# EAGLE design sensor (EAGLE 7.7.0)

## Sheet 1 of 2: MCU + Sensors
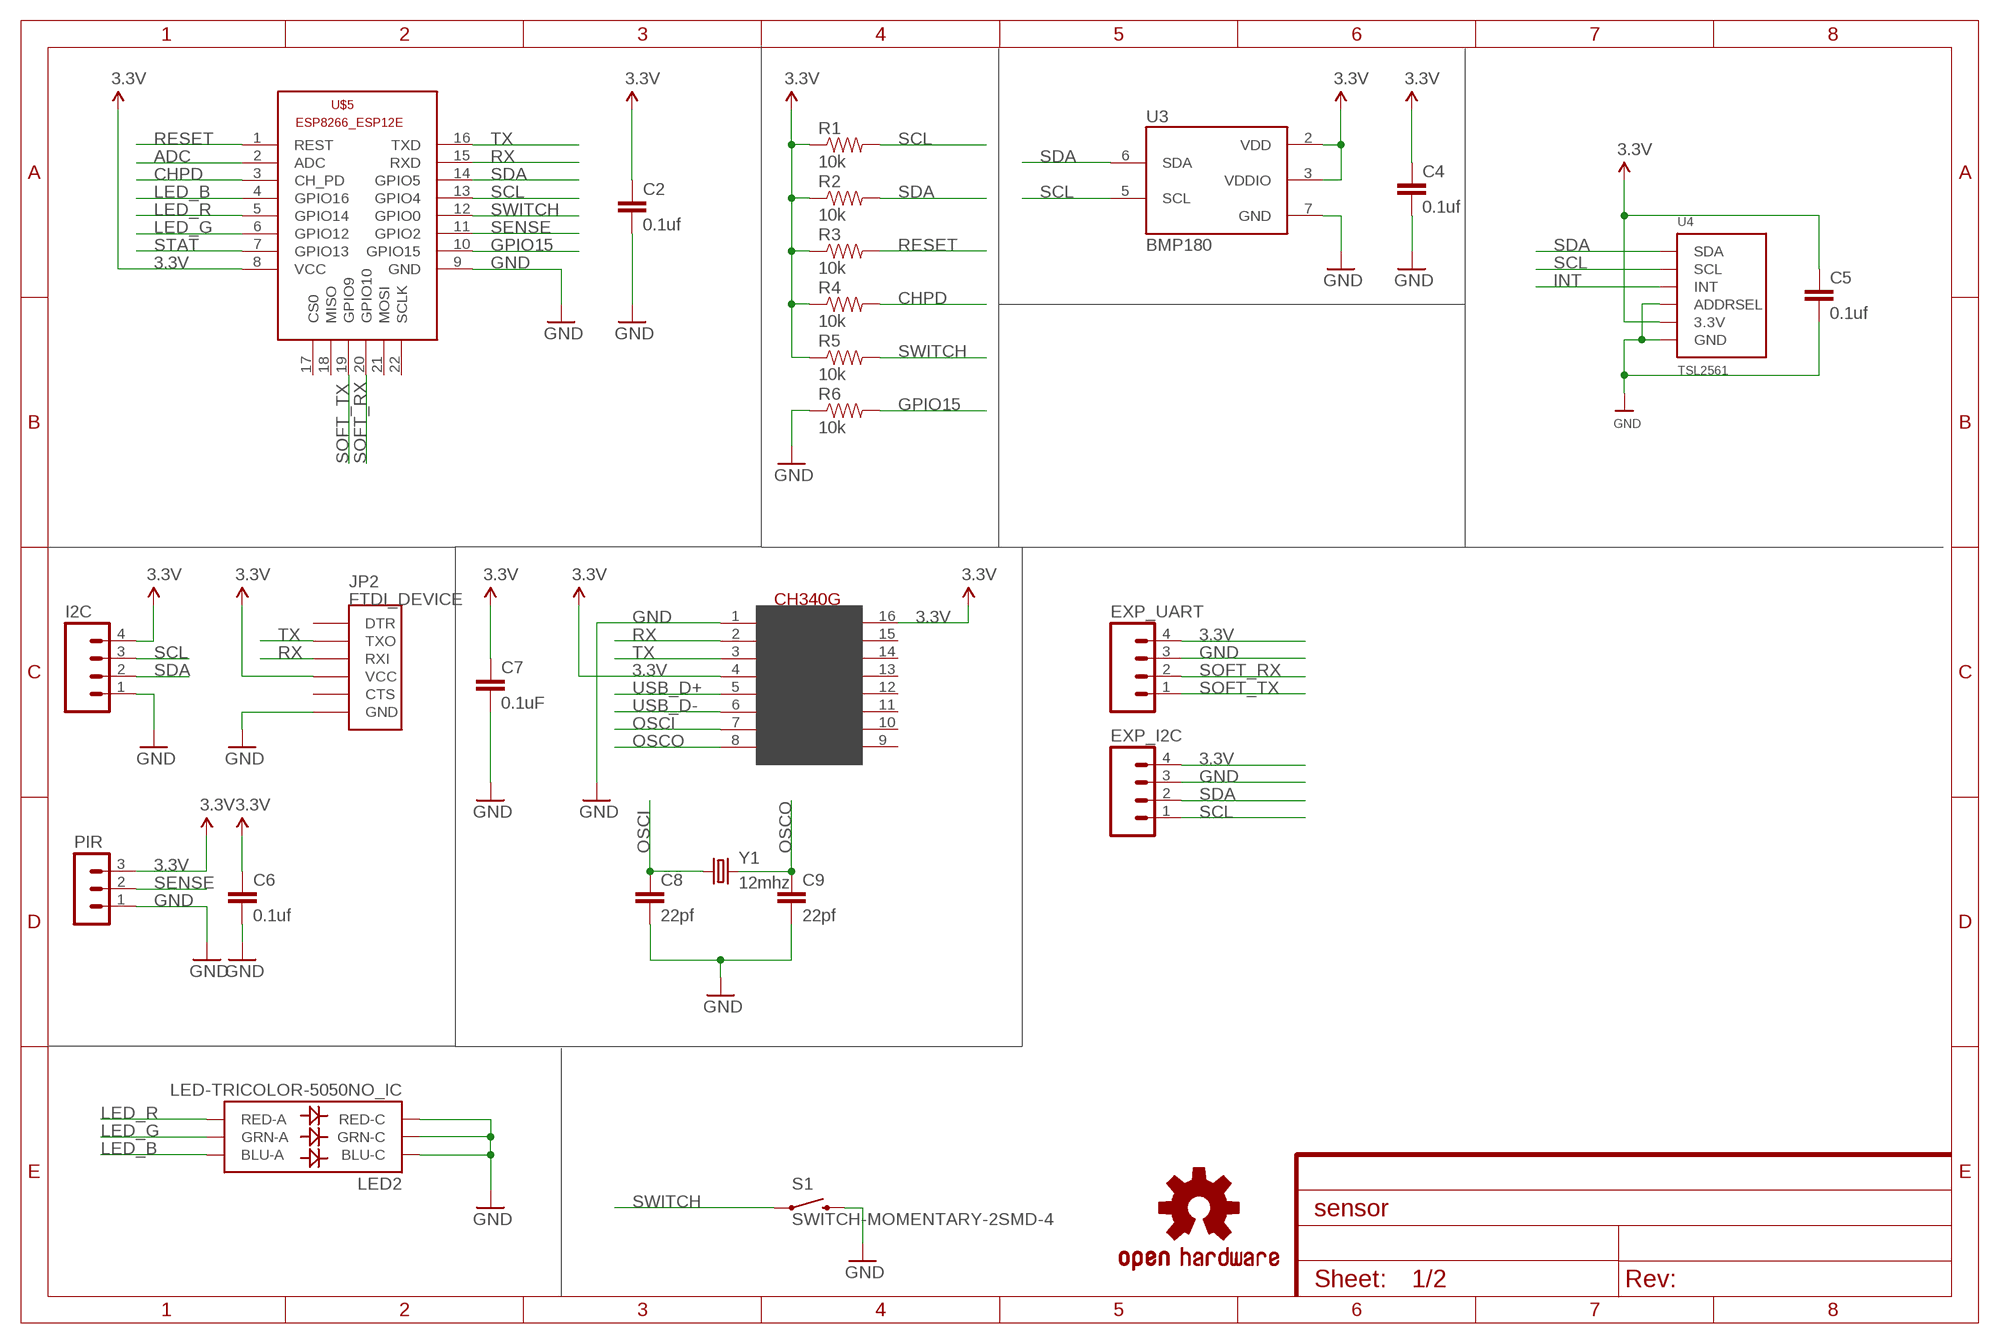
[diagram p0: schematic, sheet 1]

### Parts
C2  0.1uf  CAP0805  [0805]
C4  0.1uf  CAP0805  [0805]
C5  0.1uf  CAP0805  [0805]
C6  0.1uf  CAP0805  [0805]
C7  0.1uF  C-EUC0805  [C0805]
C8  22pf  C-EUC0805  [C0805]
C9  22pf  C-EUC0805  [C0805]
EXP_I2C  M04LOCK  [1X04_LOCK]
EXP_UART  M04LOCK  [1X04_LOCK]
I2C  M04JST-PTH  [JST-4-PTH]
JP2  FTDI_DEVICE  [FTDI_DEVICE_SIDE]
LED2  LED-TRICOLOR-5050NO_IC  [LED-TRICOLOR-5050]
LOGO1  OSHW-LOGOL  [OSHW-LOGO-L]
PIR  MA03-1  [MA03-1]
R1  10k  RESISTOR0805-RES  [0805]
R2  10k  RESISTOR0805-RES  [0805]
R3  10k  RESISTOR0805-RES  [0805]
R4  10k  RESISTOR0805-RES  [0805]
R5  10k  RESISTOR0805-RES  [0805]
R6  10k  RESISTOR0805-RES  [0805]
S1  SWITCH-MOMENTARY-2SMD-4  [TACTILE_SWITCH_TALL]
U3  BMP180  [BMP180]
U4  TSL2561  [TSL2561_FN]
U$5  ESP8266-12EESP8266-ESP12E  [ESP8266-ESP12E]
U$11  CH340G  [SOIC16]
Y1  12mhz  CRYSTALSMD  [HC49UP]

### Nets
3.3V: C2.1 C4.1 C5.1 C6.1 C7.1 EXP_I2C.4 EXP_UART.4 I2C.4 JP2.P$4(VCC) PIR.3 R1.1 R2.1 R3.1 R4.1 R5.1 U3.2(VDD) U3.3(VDDIO) U4.VDD(3.3V) U$5.8(VCC) U$11.4(V3) U$11.16(VCC) ; also sheet 2
ADC: U$5.2(ADC)
CHPD: R4.2 U$5.3(CH_PD)
GND: C2.2 C4.2 C5.2 C6.2 C7.2 C8.2 C9.2 EXP_I2C.3 EXP_UART.3 I2C.1 JP2.P$6(GND) LED2.4(BLU-C) LED2.5(RED-C) LED2.6(GRN-C) PIR.1 R6.1 S1.B2 U3.7(GND) U4.ADR(ADDRSEL) U4.VSS(GND) U$5.9(GND) U$11.1(GND) ; also sheet 2
GPIO15: R6.2 U$5.10(GPIO15)
INT: U4.INT
LED_B: LED2.3(BLU-A) U$5.4(GPIO16)
LED_G: LED2.1(GRN-A) U$5.6(GPIO12)
LED_R: LED2.2(RED-A) U$5.5(GPIO14)
OSCI: C8.1 U$11.7(XI) Y1.1
OSCO: C9.1 U$11.8(XO) Y1.2
RESET: R3.2 U$5.1(REST)
RX: JP2.P$3(RXI) U$5.15(RXD) U$11.2(TX)
SCL: EXP_I2C.1 I2C.3 R1.2 U3.5(SCL) U4.CLK(SCL) U$5.13(GPIO4)
SDA: EXP_I2C.2 I2C.2 R2.2 U3.6(SDA) U4.DATA(SDA) U$5.14(GPIO5)
SENSE: PIR.2 U$5.11(GPIO2)
SOFT_RX: EXP_UART.2 U$5.20(GPIO10)
SOFT_TX: EXP_UART.1 U$5.19(GPIO9)
STAT: U$5.7(GPIO13) ; also sheet 2
SWITCH: R5.2 S1.A2 U$5.12(GPIO0)
TX: JP2.P$2(TXO) U$5.16(TXD) U$11.3(RX)
USB_D+: U$11.5(D+) ; also sheet 2
USB_D-: U$11.6(D-) ; also sheet 2
Unconnected: JP2.P$1(DTR) JP2.P$5(CTS) U$5.17(CS0) U$5.18(MISO) U$5.21(MOSI) U$5.22(SCLK) U$11.9(CTS) U$11.10(DSR) U$11.11(RI) U$11.12(DCD) U$11.13(DTR) U$11.14(RTS) U$11.15(RS232)

## Sheet 2 of 2: Power
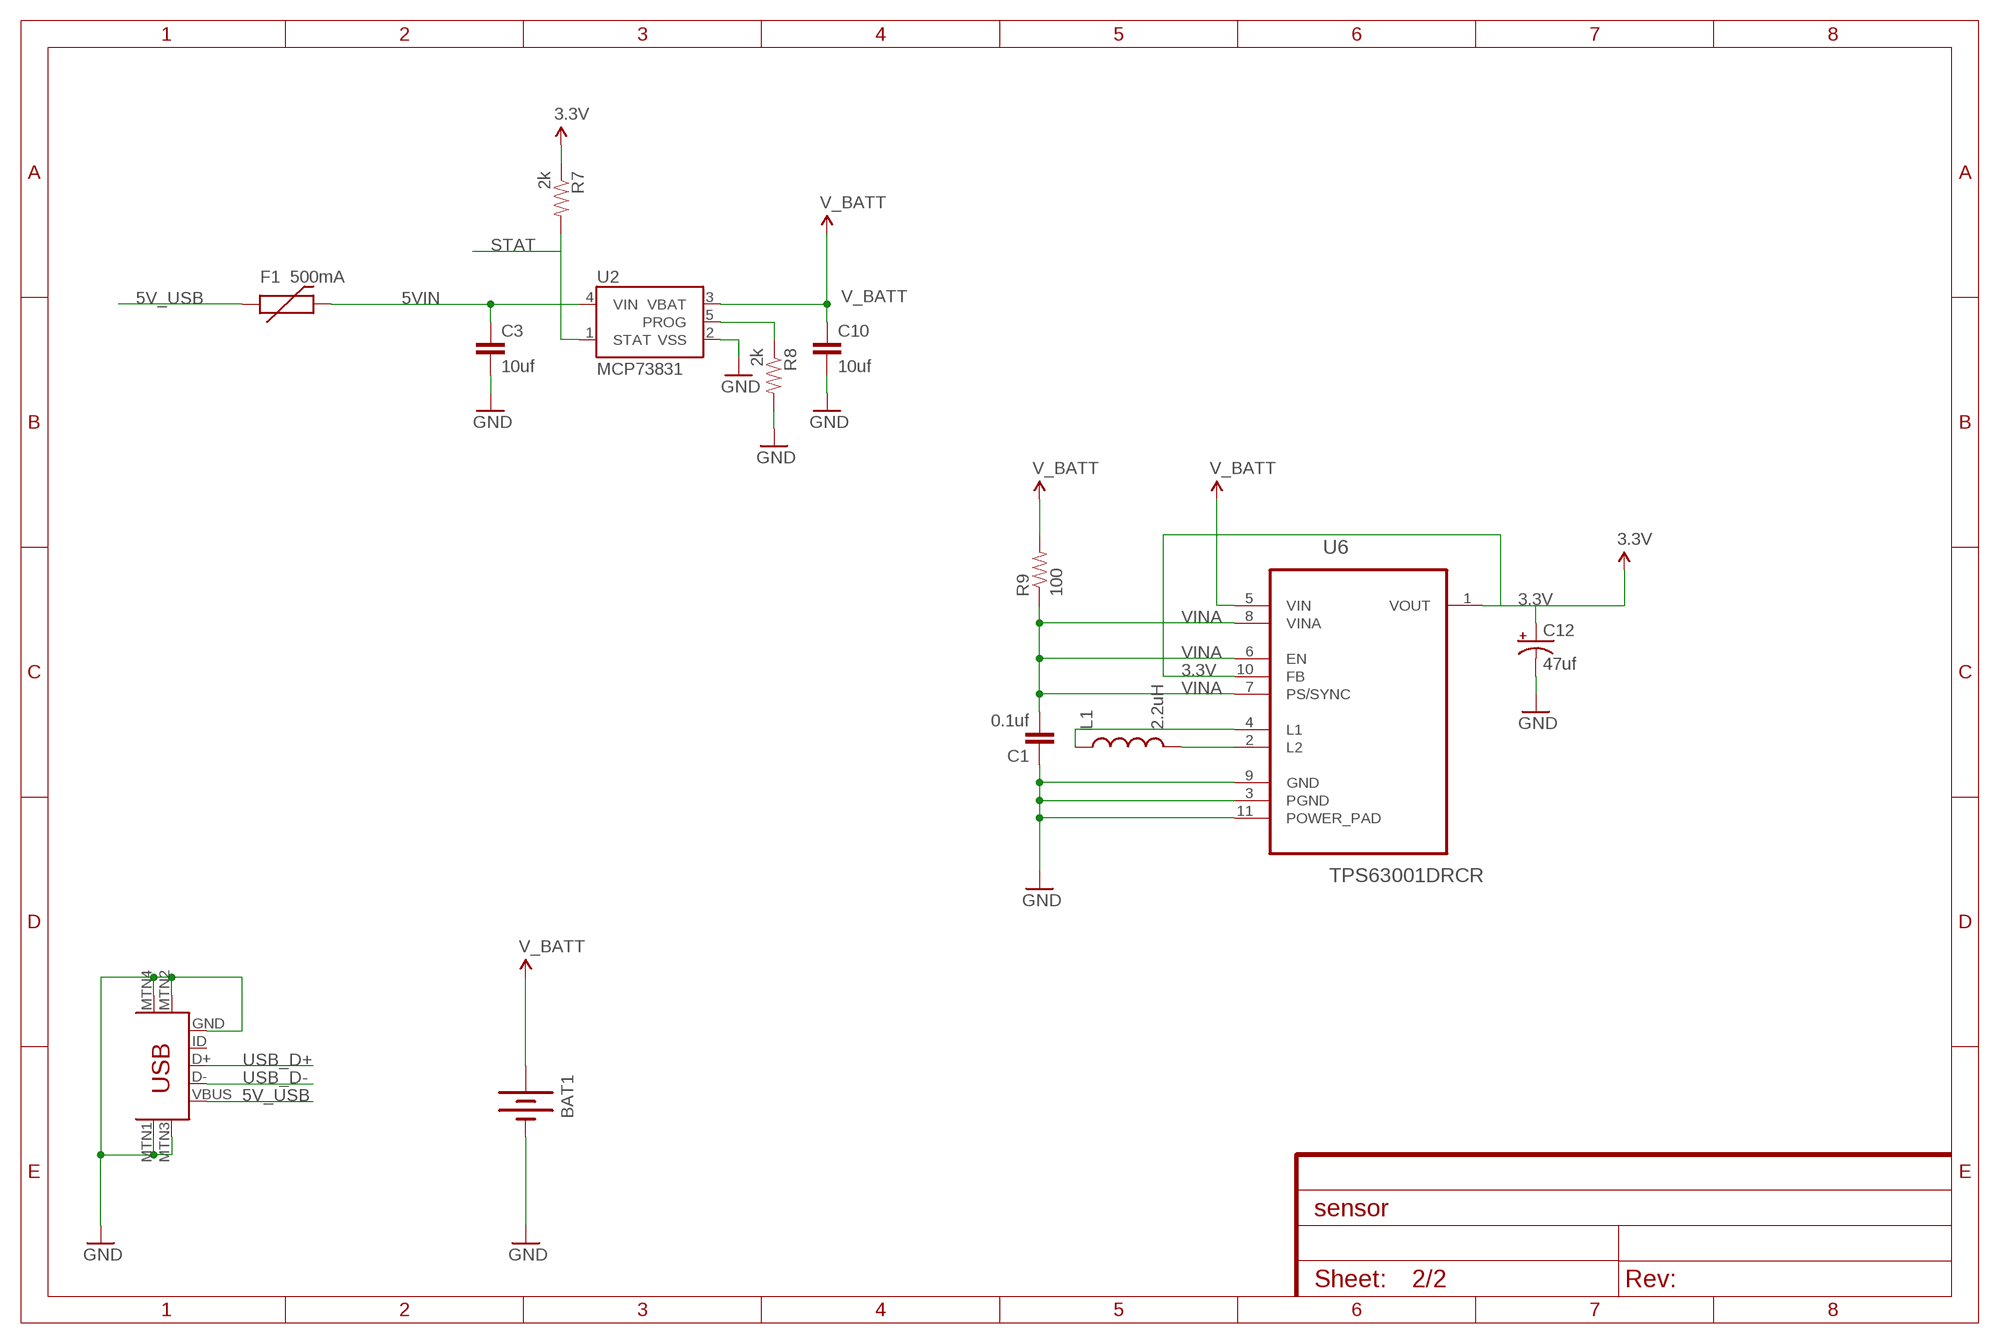
[diagram p1: schematic, sheet 2]

### Parts
BAT1  BATTERY18650  [BATTERY_18650-HOLDER]
C1  0.1uf  CAP0805  [0805]
C3  10uf  CAP0805  [0805]
C10  10uf  CAP0805  [0805]
C12  47uf  CAP_POLC  [PANASONIC_C]
F1  500mA  PTCSMD  [PTC-1206]
L1  2.2uH  INDUCTORSRU5028  [SRU5028]
R7  2k  RESISTOR0805-RES  [0805]
R8  2k  RESISTOR0805-RES  [0805]
R9  100  RESISTOR0805-RES  [0805]
U2  MCP73831  [SOT23-5]
U6  TPS63001DRCR  [SON50P300X300X100-11N]
U$6  USB-MINIB-5PIN  [USB-MINIB]

### Nets
3.3V: C12.+ R7.1 U6.1(VOUT) U6.10(FB) ; also sheet 1
5V_USB: F1.1 U$6.VBUS
5VIN: C3.1 F1.2 U2.4(VIN)
GND: BAT1.GND@1(-) C1.1 C3.2 C10.2 C12.- R8.2 U2.2(VSS) U6.3(PGND) U6.9(GND) U6.11(POWER_PAD) U$6.GND U$6.MTN1(MTN2) U$6.MTN2(MTN3) U$6.MTN3(MTN1) U$6.MTN4 ; also sheet 1
N$1: L1.2 U6.2(L2)
N$2: L1.1 U6.4(L1)
N$11: R8.1 U2.5(PROG)
STAT: R7.2 U2.1(STAT) ; also sheet 1
USB_D+: U$6.D+ ; also sheet 1
USB_D-: U$6.D- ; also sheet 1
V_BATT: BAT1.PWR@1(+) C10.1 R9.2 U2.3(VBAT) U6.5(VIN)
VINA: C1.2 R9.1 U6.6(EN) U6.7(PS/SYNC) U6.8(VINA)
Unconnected: U$6.ID

## Library data of the parts
BAT1 = SparkFun-Electromechanical:BATTERY: Battery Holders Various common sizes : AA, AAA, 18650 (PRT-12895), 20mm coin cell and 12mm coin cell. 20MM_4LEGS, BATT-10373
C1-C6 C10 = SparkFun-Capacitors:CAP: Capacitor Standard 0603 ceramic capacitor, and 0.1" leaded capacitor.
C7-C9 = rcl:C-EU: CAPACITOR, European symbol
C12 = SparkFun-Capacitors:CAP_POL: Capacitor Polarized These are standard SMD and PTH capacitors. Normally 10uF, 47uF, and 100uF in electrolytic and tantalum varieties. Always verify the external diameter of the through hole cap, it varies with capacity, voltage, and manufacturer. The EIA devices should be standard.
EXP_I2C EXP_UART = SparkFun-Connectors:M04: Header 4 Standard 4-pin 0.1" header. Use with straight break away headers (SKU : PRT-00116), right angle break away headers (PRT-00553), swiss pins (PRT-00743), machine pins (PRT-00117), and female headers (PRT-00115). Molex polarized connector foot print use with SKU : PRT-08231 with associated crimp pins and housings. 1MM SMD Version SKU: PRT-10208; PROD_ID: CONN-09696
F1 = SparkFun:PTC: Resettable Fuse PTC Resettable Fuse. Spark Fun Electronics SKU : COM-08357
I2C = SparkFun-Connectors:M04: Header 4 Standard 4-pin 0.1" header. Use with straight break away headers (SKU : PRT-00116), right angle break away headers (PRT-00553), swiss pins (PRT-00743), machine pins (PRT-00117), and female headers (PRT-00115). Molex polarized connector foot print use with SKU : PRT-08231 with associated crimp pins and housings. 1MM SMD Version SKU: PRT-10208; SKU: PRT-09916
JP2 = SparkFun-Connectors:FTDI_DEVICE: Connector which mates to FTDI basic or FTDI cable.
L1 = SparkFun-Passives:INDUCTOR: Inductors Basic Inductor/Choke - 0603 and 1206. Footprints are not proven and vary greatly between part numbers. INDUCTOR POWER 3.3UH 4.0A SMD 0.197" L x 0.197" W x 0.177" H (5.00mm x 5.00mm x 4.50mm)
LED2 = SparkFun-LED:LED-TRICOLOR-5050; PROD_ID: DIO-10298
LOGO1 = SparkFun-Aesthetics:OSHW-LOGO: Open Source Hardware Logo This logo indicates the piece of hardware it is found on incorporates a OSHW license and/or adheres to the definition of open source hardware found here: http://freedomdefined.org/OSHW
PIR = con-lstb:MA03-1: PIN HEADER; OC_FARNELL: unknown; OC_NEWARK: unknown
R1-R9 = SparkFun-Resistors:RESISTOR: Resistor Basic schematic elements and footprints for 0603, 1206, and PTH resistors.
S1 = SparkFun-Electromechanical:SWITCH-MOMENTARY-2: Various NO switches- pushbuttons, reed, etc; PROD_ID: SWCH-11966
U2 = SparkFun:MCP73831: Microchip's MCP73831 Miniature single cell, fully integrated Li-Ion, Li-polymer charge management controller http://ww1.microchip.com/downloads/en/DeviceDoc/21984a.pdf
U3 = SparkFun-Sensors:BMP180: BOSCH BMP180 DIGITAL BAROMETRIC PRESSURE SENSOR Web page: http://www.bosch-sensortec.com/en/homepage/products_3/environmental_sensors_1/bmp180_1/bmp180 Datasheet: http://ae-bst.resource.bosch.com/media/products/dokumente/bmp180/BST-BMP180-DS000-09.pdf The BMP180 is the function compatible successor of the BMP085, a new generation of high precision digital pressure sensors for consumer applications. The ultra-low power, low voltage electronics of the BMP180 is optimized for use in mobile phones, PDAs, GPS navigation devices and outdoor equipment. With a low altitude noise of merely 0.25m at fast conversion time, the BMP180 offers superior performance. The I2C interface allows for easy system integration with a microcontroller. The BMP180 is based on piezo-resistive technology for EMC robustness, high accuracy and linearity as well as long term stability. Key features: - Temperature measurement included - I2C interface - Fully calibrated - Pb-free, halogen-free and RoHS compliant, - MSL 1 Basic specs: Pressure range: 300 to 1100hPa (+9000m to -500m relating to sea level) Supply voltage: 1.8 to 3.6V (VDD), 1.62V to 3.6V (VDDIO) Package: LGA package with metal lid Small footprint: 3.6mm x 3.8mm Super-flat: 0.93mm height Low power: 5μA at 1 sample / sec. in standard mode Low noise: 0.06hPa (0.5m) in ultra low power mode, 0.02hPa (0.17m) advanced resolution mode Typical applications: - Enhancement of GPS navigation (dead-reckoning, slope detection, etc.) - In- and out-door navigation - Leisure and sports - Weather forecast - Vertical velocity indication (rise/sink speed)
U4 = microbuilder:TSL2561: TSL2561 Light-To-Digital Sensor Mouser Part Numbers: CS (obsolete): 856-TSL2561CS DFN (cheapest): 856-TSL2561FN
U6 = Texas Instruments_By_element14_Batch_1:TPS63001DRCR: HIGH EFFICIENT SINGLE INDUCTOR BUCK-BOOST CONVERTER WITH 1.8-A SWITCHES; MPN: TPS63001DRCR; OC_FARNELL: -; OC_NEWARK: 85K1711; PACKAGE: SON-10; SUPPLIER: TEXAS INSTRUMENTS
U$5 = ESP8266-ESP12E:ESP8266-12E: ESP8266-12E with additional I/O and GPIO04/05 corrected The author cannot warrant that this library is free from error or will meet your specific requirements. Created by PuceBaboon.com. Komagane, Nagano, JAPAN
U$6 = SparkFun-Connectors:USB-MINIB: Mini-USB "B" connector with 5th pin broken out. Created new symbol breaking out 5th "ID" pin in mini/micro USB connector spec. See: http://en.wikipedia.org/wiki/Mini_usb#Cables. Uses same footprint as 4-pin symbol. Also added pins to connect to mounting / shield pads if required (probably not generally needed as signals aren't shielded once they leave the connector).
U$11 = CH340G-USB-SERIAL:CH340G
Y1 = SparkFun-FreqCtrl:CRYSTAL: Various standard crystals. Proven footprints.

## Board
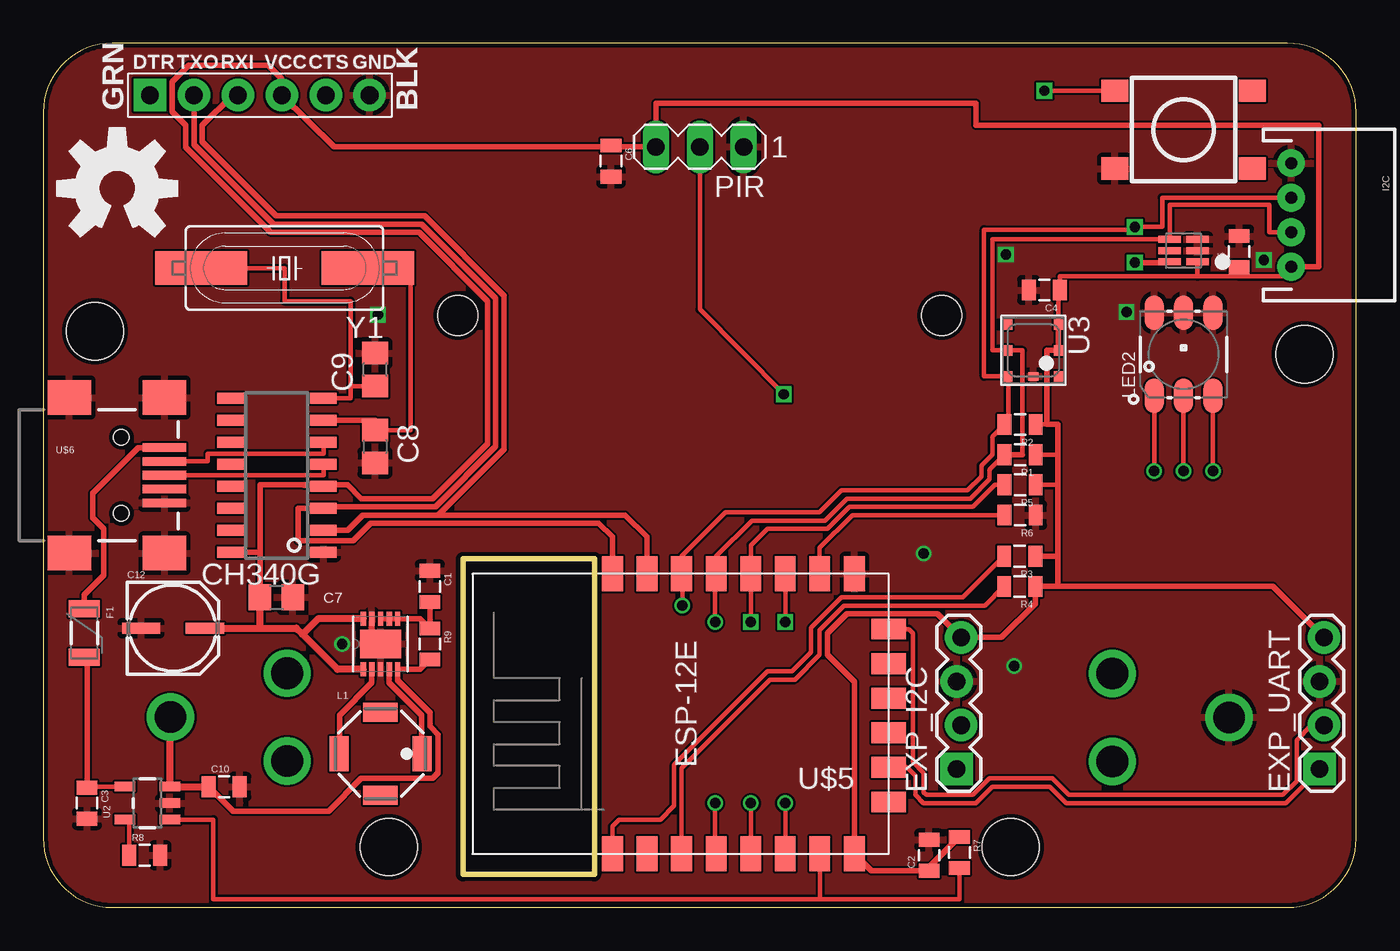
[diagram p2: board, top side]
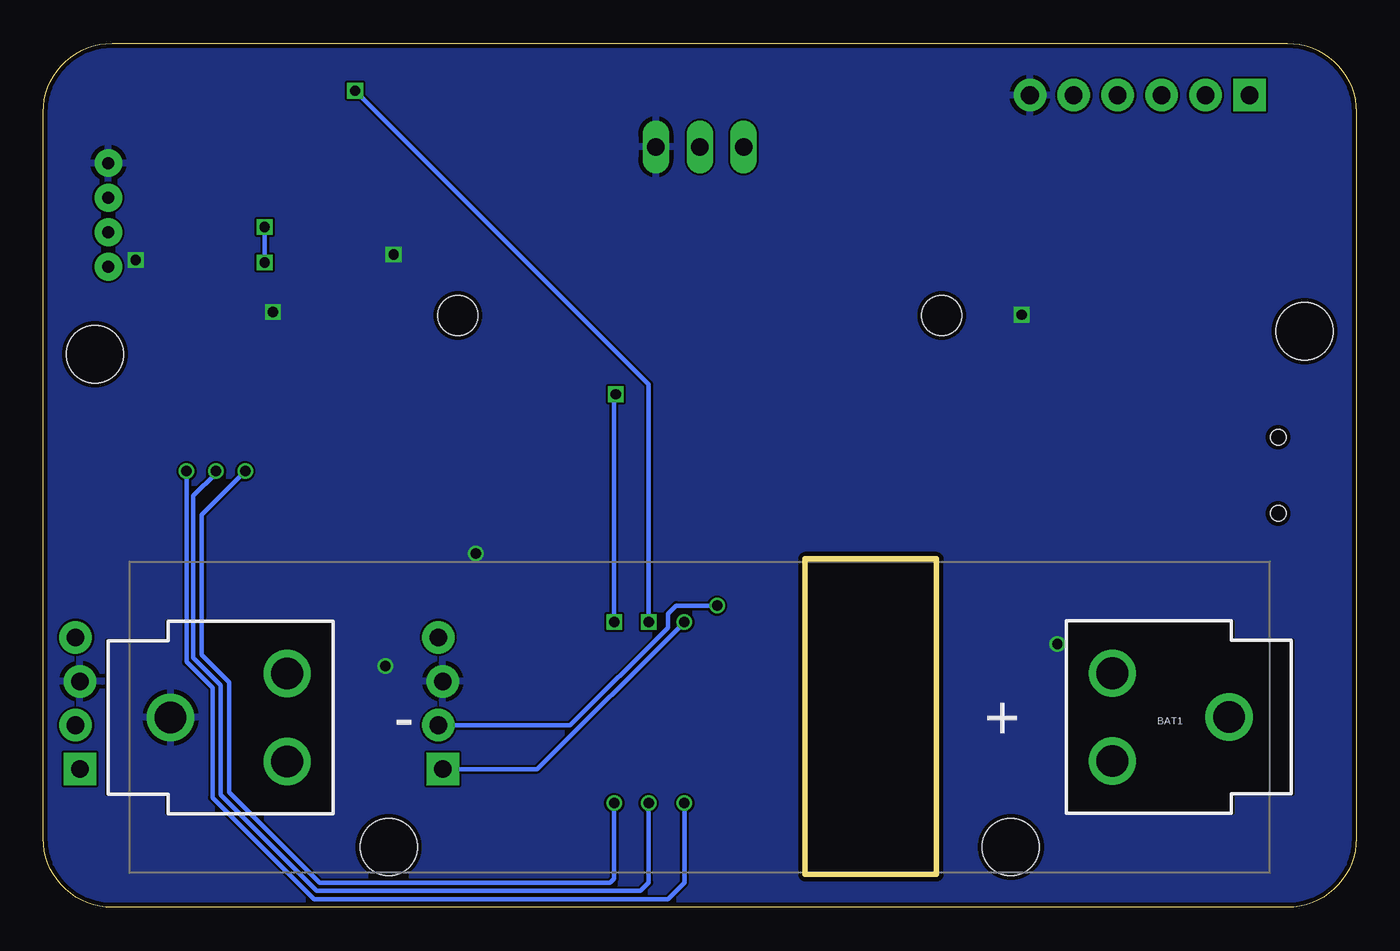
[diagram p3: board, bottom side, seen from below]

Size 76 x 50 mm. Coordinates in mm from the lower left corner, seen from the top.
Outline: 4,0 72,0 arc90 76,4 76,46 arc90 72,50 4,50 arc90 0,46 0,4 arc90 4,0
Copper layers (1*16): Top 0.035mm / dielectric 1.5mm / Bottom 0.035mm
Design rules "dirtypcbs": minimum track width 5mil, minimum drill 12mil, track to track 5mil, track to pad 5mil, pad to pad 5mil, via to via 5mil, smd to smd 0mil, copper to edge 10mil, drill to drill 10mil, minimum pad ring 10mil, minimum via ring 6mil, stop-mask expansion 2mil, vias tented up to drill 25mil, thermal gap 10mil
Holes 2.3 mm at 52,34.25 24,34.25
Holes 3.3 mm at 3,33.33 73,32 20,3.5 56,3.5

### Footprints (pad centres in the part's own frame; a part is rotated, then mirrored left to right if it is on the bottom)
BATTERY_18650-HOLDER = drill 1.829: GND@1 30.628,0.01; GND@2 23.88,2.55; GND@3 23.88,-2.53; PWR@1 -30.628,-0.01; PWR@2 -23.88,2.53; PWR@3 -23.88,-2.55
0805 = smd 0.8 x 1.2: 1 -0.9,0; 2 0.9,0
C0805 = smd 1.3 x 1.5: 1 -0.95,0; 2 0.95,0
PANASONIC_C = smd 2.2 x 0.65: + 1.9,-0.2; - -1.8,-0.2
1X04_LOCK = drill 1.016 pad 1.88 square: 1 0,0.127 | drill 1.016 pad 1.88: 2 2.54,-0.127; 3 5.08,0.127; 4 7.62,-0.127
PTC-1206 = smd 1 x 1.8: 1 -1.4,0; 2 1.4,0
JST-4-PTH = drill 0.7 pad 1.6: 1 -3,0; 2 -1,0; 3 1,0; 4 3,0
FTDI_DEVICE_SIDE = drill 1.016 pad 1.88 square: P$1 -6.35,0 | drill 1.016 pad 1.88: P$2 -3.81,0; P$3 -1.27,0; P$4 1.27,0; P$5 3.81,0; P$6 6.35,0
SRU5028 = smd 1.1 x 2: 1 2.4,0; 2 -2.4,0 | smd 2 x 1.1: P$1 0,2.4; P$2 0,-2.4
LED-TRICOLOR-5050 = smd 2 x 1.1: 1 -2.4,1.7; 2 -2.4,0; 3 -2.4,-1.7; 4 2.4,-1.7; 5 2.4,0; 6 2.4,1.7
MA03-1 = drill 1.016 long: 1 -2.54,0; 2 0,0; 3 2.54,0
TACTILE_SWITCH_TALL = smd 1.55 x 1.3: A1 -3.975,-2.25; A2 3.975,-2.25; B1 -3.975,2.25; B2 3.975,2.25
SOT23-5 = smd 0.55 x 1.2: 1 -0.95,-1.3; 2 0,-1.3; 3 0.95,-1.3; 4 0.95,1.3; 5 -0.95,1.3
BMP180 = smd 0.6 x 0.5: 1 1.5,1.45; 2 0,1.45; 3 -1.5,1.45; 4 -1.5,-1.45; 5 0,-1.45; 6 1.5,-1.45 | smd 0.5 x 0.6: 7 1.5,0
TSL2561_FN = smd 1.3 x 0.4: ADR -0.8,0; CLK 0.8,-0.65; DATA 0.8,0.65; INT 0.8,0; VDD -0.8,0.65; VSS -0.8,-0.65
SON50P300X300X100-11N = smd 0.813 x 0.305: 1 -1.473,0.991; 2 -1.473,0.508; 3 -1.473,0; 4 -1.473,-0.508; 5 -1.473,-0.991; 6 1.473,-0.991; 7 1.473,-0.508; 8 1.473,0; 9 1.473,0.508; 10 1.473,0.991 | smd 1.651 x 2.388: 11 0,0
ESP8266-ESP12E = smd 2 x 1.2: 1 0,16; 2 0,14; 3 0,12; 4 0,10; 5 0,8; 6 0,6; 7 0,4; 8 0,2; 9 16.2,2; 10 16.2,4; 11 16.2,6; 12 16.2,8; 13 16.2,10; 14 16.2,12; 15 16.2,14; 16 16.2,16 | smd 1.2 x 2: 17 11,0; 18 3,0; 19 5,0; 20 13,0; 21 7,0; 22 9,0
USB-MINIB = smd 2.5 x 0.5: D+ 2.5,0; D- 2.5,0.8; GND 2.5,-1.6; ID 2.5,-0.8; VBUS 2.5,1.6 | smd 2.5 x 2: MTN1 -3,4.5; MTN2 2.5,4.5; MTN3 -3,-4.5; MTN4 2.5,-4.5 | hole 0.9: 0,2.2; 0,-2.2
SOIC16 = smd 0.635 x 1.524: 1 -4.445,-2.695; 2 -3.175,-2.695; 3 -1.905,-2.695; 4 -0.635,-2.695; 5 0.635,-2.695; 6 1.905,-2.695; 7 3.175,-2.695; 8 4.445,-2.695; 9 4.445,2.695; 10 3.175,2.695; 11 1.905,2.695; 12 0.635,2.695; 13 -0.635,2.695; 14 -1.905,2.695; 15 -3.175,2.695; 16 -4.445,2.695
HC49UP = smd 5.334 x 1.93: 1 -4.826,0; 2 4.826,0

### Placement (x,y rotation side)
BAT1  38,11 180 bottom
C1  22.38,18.57 270 top
C2  51.28,3.02 90 top
C3  2.54,6.03 270 top
C4  57.94,35.72 180 top
C5  69.22,37.94 90 top
C6  32.86,43.18 270 top
C7  13.49,17.94 0 top
C8  19.21,26.67 270 top
C9  19.21,31.11 90 top
C10  10.48,6.99 0 top
C12  7.46,16.35 0 top
EXP_I2C  53,8 90 top
EXP_UART  74,8 90 top
F1  2.38,15.88 270 top
I2C  72.23,40.06 270 top
JP2  12.54,46.99 0 top
L1  19.53,8.89 0 top
LED2  66,32 90 top
LOGO1  4.29,41.59 0 top
PIR  38,44 180 top
R1  56.54,26.19 180 top
R2  56.54,27.94 180 top
R3  56.52,20.32 180 top
R4  56.52,18.57 180 top
R5  56.54,24.45 180 top
R6  56.54,22.7 180 top
R7  53.02,3.17 270 top
R8  5.87,3.02 0 top
R9  22.38,15.24 270 top
S1  66,45 180 top
U2  6.03,6.03 90 top
U3  57.31,32.23 270 top
U4  66,38 180 top
U6  19.53,15.24 90 top
U$5  48.95,3.1 90 top
U$6  4.52,25 0 top
U$11  13.52,25 90 top
Y1  13.97,36.99 180 top

### Tracks (layer width: path | path; a pad name or v marks a point on that pad's centre or on a via)
3.3V
  Top 0.254: 58.1,27.94 R2.1 | R1.1 58.74,26.19 | R5.1 58.74,24.45 | U3.3 58.76,35.72 | U4.VDD 66.8,36.51 | 66.8,36.51 58.84,36.51 C4.1 | C5.1 69.22,36.51 | 69.22,36.51 66.8,36.51 | 69.22,36.51 72.23,36.51 I2C.4 | U$11.4 12.54,24.45
  Top 0.305: 58.74,18.57 R4.1 57.42,17.57 55.47,15.62 EXP_I2C.4 51.76,16.99 46.51,16.99 45.4,15.88 45.4,14.61 46.95,13.06 U$5.8 47.93,2.12 C2.1 51.28,2.33 R7.1 | 58.74,18.57 58.74,20.32 | 58.74,20.32 58.74,24.45 58.74,26.19 58.74,27.94 58.1,27.94 58.1,32.23 U3.2 U3.3 | R3.1 58.74,20.32 | 58.76,35.72 C4.1 | C7.1 12.54,20.55 | 12.54,20.55 U$11.16 | 12.54,20.55 12.54,24.45 17.62,24.45 18.41,23.65 22.54,23.65 25.72,26.83 25.72,35.08 21.75,39.05 13.18,39.05 8.26,43.97 8.26,45.24 7.46,46.04 7.46,47.78 8.41,48.74 13.02,48.74 13.81,47.94 JP2.P$4 16.83,44 PIR.3 | PIR.3 35.46,46.51 53.98,46.51 53.98,45.24 73.82,45.24 73.82,37.06 I2C.4 | 58.74,18.57 71.17,18.57 EXP_UART.4 | C6.1 33.18,44 PIR.3
  Top 0.406: C12.+ 12.54,16.15 | 12.54,16.15 C7.1 | U6.1 17.03,13.77 15,15.8 | 15,15.8 14.65,16.15 12.54,16.15 | U6.10 15.92,16.71 15,15.8
5V_USB
  Top 0.305: F1.1 2.38,18.1 3.49,19.21 3.49,21.91 2.86,22.54 2.86,23.97 5.49,26.6 U$6.VBUS
5VIN
  Top 0.254: U2.4 2.54,6.98 C3.1
  Top 0.305: 2.54,6.98 2.54,14.32 F1.2
CHPD
  Top 0.254: R4.2 54.51,17.46 46.35,17.46 44.93,16.03 44.93,14.61 43.5,13.18 42.07,13.18 36.95,8.05 U$5.3
GND  (via drill 0.6)
  Top 0.305: U6.9 19.02,15.75 U6.11
  other vias: 55.72,37.78 62.71,34.45 70.64,37.47 19.37,34.29 17.3,15.24 50.96,20.48 56.2,13.97
  pour Top: 76,64 40.1,64 23.9,64 0,64 0,0 76,0
  pour Bottom: 76,64 42,64 22,64 0,64 0,0 76,0
GPIO15
  Top 0.254: R6.2 46.83,22.7 44.93,20.8 44.93,19.32
  Top 0.305: 44.93,19.32 U$5.10
LED_B  (via drill 0.6)
  Top 0.254: LED2.3 v67.7,25.24 | U$5.4 38.89,3.1 v38.89,6.03
  Bottom 0.254: v67.7,25.24 67.7,14.2 66.2,12.7 66.2,6.35 60.33,0.48 39.85,0.48 38.89,1.43 v38.89,6.03
LED_G  (via drill 0.6)
  Top 0.254: LED2.1 v64.3,25.24 | U$5.6 v42.95,6.03
  Bottom 0.254: v64.3,25.24 66.83,22.71 66.83,14.61 65.25,13.02 65.25,6.67 60.01,1.43 43.18,1.43 42.95,1.66 v42.95,6.03
LED_R  (via drill 0.6)
  Top 0.254: LED2.2 v66,25.24 | v40.96,6.03 40.96,3.11 U$5.5
  Bottom 0.254: v66,25.24 66,25.12 67.31,23.81 67.31,14.45 65.72,12.86 65.72,6.51 60.17,0.95 41.43,0.95 40.96,1.43 v40.96,6.03
N$1
  Top 0.305: U6.2 19.02,12.99 17.14,11.11 17.14,8.59 L1.2
N$2
  Top 0.305: U6.4 20.03,12.99 21.91,11.11 21.91,8.59 L1.1
N$11
  Top 0.254: U2.5 4.97,5.08 R8.1
OSCI
  Top 0.254: C8.1 21.27,27.62 21.27,36.99 Y1.1
  Top 0.305: U$11.7 19.21,28.18 C8.1
OSCO
  Top 0.254: Y1.2 13.97,36.99 13.97,35.08 17.78,35.08 17.78,30.16 | 17.78,30.16 17.78,29.45 U$11.8 | C9.1 17.78,30.16
RESET
  Top 0.254: R3.2 53.24,17.94 46.2,17.94 44.45,16.19 44.45,14.76 43.34,13.65 41.91,13.65 36.51,8.26 36.51,5.87 35.72,5.08 33.34,5.08 32.95,4.69 U$5.1
RX
  Top 0.305: U$11.2 17.62,21.82 18.5,22.7 22.86,22.7 | JP2.P$3 10.95,46.99 9.21,45.24 9.21,44.29 13.49,40.01 22.07,40.01 26.67,35.4 26.67,26.51 22.86,22.7 | 22.86,22.7 33.68,22.7 34.95,21.43 U$5.15
SCL  (via drill 0.6)
  Top 0.254: R1.2 54.77,25.32 54.77,24.77 53.66,23.65 46.51,23.65 45.24,22.38 41.01,22.38 38.95,20.32 U$5.13 38.89,19.25 v38.89,16.51 | 56.67,26.19 56.67,32.23 U3.5 54.93,32.23 54.93,38.65 U4.CLK 65.2,40.64 70.96,40.64 70.96,39.06 I2C.3
  Top 0.305: R1.2 56.67,26.19
  Bottom 0.254: EXP_I2C.1 47.4,8 v38.89,16.51
SDA  (via drill 0.6)
  Top 0.254: R2.2 54.93,27.23 54.93,26.19 54.29,25.56 54.29,24.92 53.5,24.13 46.2,24.13 44.93,22.86 39.49,22.86 36.95,20.32 36.99,20.28 36.99,19.21 | 55.86,27.94 U3.6 54.45,30.73 54.45,39.21 63.18,39.21 v63.18,39.37 64.77,39.37 64.77,41.06 I2C.2 | v36.99,17.46 36.99,19.21 | U$5.14 36.95,19.25 36.99,19.21
  Top 0.305: R2.2 55.86,27.94 | v63.18,37.31 65.2,37.31 U4.DATA
  Bottom 0.254: v63.18,39.37 v63.18,37.31 | EXP_I2C.2 45.5,10.54 39.85,16.19 39.85,16.99 39.37,17.46 v36.99,17.46
SENSE  (via drill 0.6)
  Top 0.254: PIR.2 38,34.61 v42.86,29.69 | U$5.11 v42.95,16.51
  Bottom 0.254: v42.95,16.51 42.95,29.69 v42.86,29.69
SOFT_RX
  Top 0.254: U$5.20 50.09,16.1 50.32,15.88 50.32,8.41 50.96,7.78 50.96,6.67 51.12,6.51 53.82,6.51 54.77,7.46 58.42,7.46 59.37,6.51 71.75,6.51 72.55,7.3 72.55,9.68 73.41,10.54 EXP_UART.2
SOFT_TX
  Top 0.254: U$5.19 50,8.1 50.48,7.62 50.48,6.51 50.96,6.03 53.98,6.03 54.93,6.99 58.26,6.99 59.21,6.03 71.91,6.03 EXP_UART.1
STAT
  Top 0.254: R7.2 53.02,0.48 44.95,0.48 | U$5.7 44.95,0.48 | 44.95,0.48 9.84,0.48 9.84,5.08 U2.1
SWITCH  (via drill 0.6)
  Top 0.254: R5.2 55.09,24.45 53.82,23.18 46.67,23.18 45.4,21.91 41.91,21.91 40.96,20.95 40.96,19.31 v40.96,16.51 | S1.A2 v57.94,47.25
  Top 0.305: 40.96,19.31 U$5.12
  Bottom 0.254: v57.94,47.25 40.96,30.26 v40.96,16.51
TX
  Top 0.305: U$5.16 32.95,21.43 32.15,22.23 18.96,22.23 17.94,21.21 14.76,21.21 14.76,23.09 U$11.3 16.22,23.18 22.7,23.18 26.19,26.67 26.19,35.24 21.91,39.53 13.34,39.53 8.73,44.13 JP2.P$2
USB_D+
  Top 0.254: U$11.5 16.22,25 U$6.D+
USB_D-
  Top 0.254: U$11.6 16.22,26.25 9.53,26.25 9.53,25.8 U$6.D-
V_BATT
  Top 0.305: R9.2 21.81,13.77 U6.5 20.52,13.14 22.38,11.27 22.38,10.48 22.86,10 22.86,7.78 22.54,7.46 18.41,7.46 16.51,5.56 11.01,5.56 C10.1
  Top 0.406: BAT1.PWR@1 7.33,11.01 U2.3 C10.1
VINA
  Top 0.305: U6.8 U6.7 U6.6 21.81,16.71 R9.1 C1.2